# EAGLE design brick_i2c_color_mini (EAGLE 7.4.0)
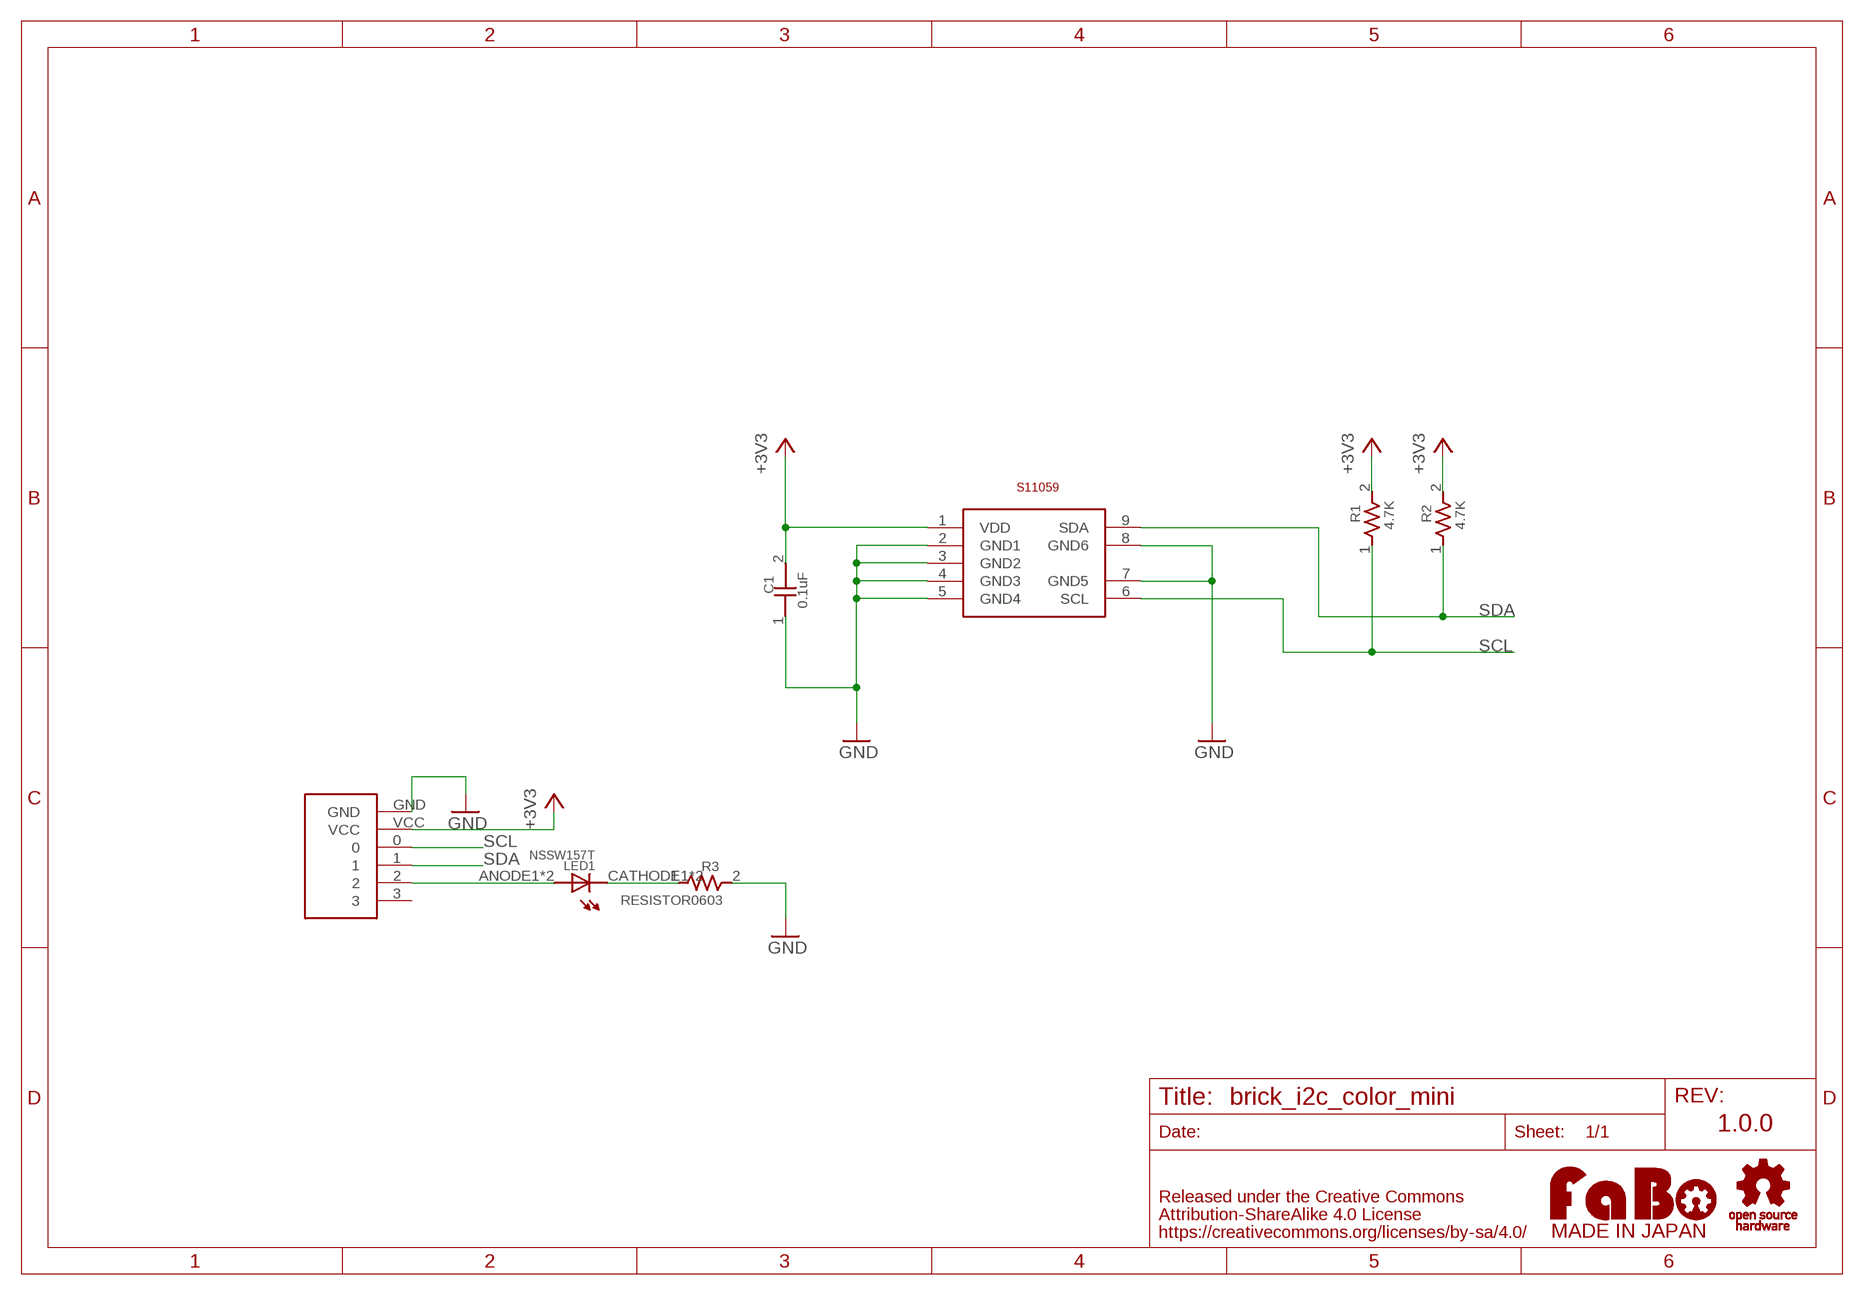
[diagram p0: schematic, sheet 1]

## Parts
C1  0.1uF  CAPACITOR0603  [0603]
LED1  NSSW157T  [NSSW157T]
R1  4.7K  RESISTOR0603  [0603]
R2  4.7K  RESISTOR0603  [0603]
R3  RESISTOR0603  [0603]
S1  HAMAMATSU-S11059  [HAMAMATSU-S11059]
U$2  LOGO_FABO-S_BOTTOM  [LOGO_FABO_S_BOTTOM]
U$3  LOGO_OSHW-S_BOTTOM  [LOGO_OSHW_S_BOTTOM]
U$4  FABO-NANO  [FABO-NANO]

## Nets
+3V3: C1.2 R1.2 R2.2 S1.1(VDD) U$4.VCC
GND: C1.1 R3.2 S1.2(GND1) S1.3(GND2) S1.4(GND3) S1.5(GND4) S1.7(GND5) S1.8(GND6) U$4.GND
N$1: LED1.ANODE1(ANODE) LED1.ANODE2(ANODE) U$4.2
N$2: LED1.CATHODE1(CATHODE) LED1.CATHODE2(CATHODE) R3.1
SCL: R1.1 S1.6(SCL) U$4.0
SDA: R2.1 S1.9(SDA) U$4.1
Unconnected: U$4.3

## Notes on the sheet
- 1.0.0

## Library data of the parts
C1 = GClue-Capacitor:CAPACITOR
LED1 = FaBo-LED:NSSW157T
R1 R2 = GClue-Resistors:RESISTOR
R3 = FaBo-Resistors:RESISTOR
S1 = gclueSensor:HAMAMATSU-S11059
U$2 = FaBo-etc:LOGO_FABO
U$3 = FaBo-etc:LOGO_OSHW
U$4 = FaBo-Template:FABO-NANO

## Board
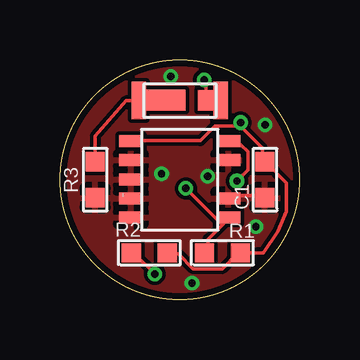
[diagram p1: board, top side]
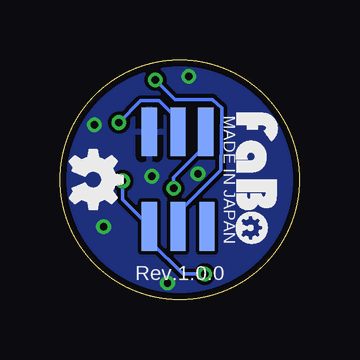
[diagram p2: board, bottom side, seen from below]

Size 10 x 10 mm. Coordinates in mm from the lower left corner, seen from the top.
Copper layers (1*16): Top 0.035mm / dielectric 1.5mm / Bottom 0.035mm
Design rules "Elecrow_2-layer_eagle_rule": minimum track width 6mil, minimum drill 12mil, track to track 6mil, track to pad 6mil, pad to pad 6mil, via to via 6mil, smd to smd 0mil, copper to edge 10mil, drill to drill 10mil, minimum pad ring 10mil, minimum via ring 6mil, stop-mask expansion 2mil, vias tented up to drill 100mil, thermal gap 10mil

### Footprints (pad centres in the part's own frame; a part is rotated, then mirrored left to right if it is on the bottom)
0603 = smd 0.8 x 0.8: 1 -0.75,0; 2 0.75,0
NSSW157T = smd 0.6 x 1.55: ANODE1 1.7,0.01; CATHODE2 -1.71,0.01 | smd 0.64 x 0.86: ANODE2 1.08,0.01 | smd 1.66 x 0.86: CATHODE1 -0.59,0.02
HAMAMATSU-S11059 = smd 1 x 0.5: 1 -2.04,1.62; 2 -2.04,0.82; 3 -2.04,0.02; 4 -2.04,-0.78; 5 -2.04,-1.58; 6 2.03,-1.58; 7 2.03,-0.78; 8 2.03,0.82; 9 2.03,1.62
FABO-NANO = smd 0.635 x 2.032 bottom: 0 -1.08,2; 1 1.27,-1.95; 2 0.07,-1.95; 3 -1.13,-1.95; GND 1.27,2; VCC 0.07,2

### Placement (x,y rotation side)
C1  8.56,5 90 top
LED1  5,8.3 0 top
R1  6.78,1.95 0 top
R2  3.73,1.95 0 top
R3  1.47,5 270 top
S1  5,5 0 top
U$2  2.66,5 90 top
U$3  8.61,5 90 top
U$4  5,5 0 top

### Tracks (layer width: path | path; a pad name or v marks a point on that pad's centre or on a via)
+3V3  (via drill 0.3)
  Top 0.152: R2.2 4.49,1.9 4.95,1.9 5.56,1.29 6.78,1.29 7.39,1.9 R1.2 8.48,1.95 9.09,2.84 9.45,3.68 9.45,4.87 8.61,5.71 C1.2 8.45,5.86 8.45,6.32 7.54,7.24 | 7.54,7.24 6.47,7.24 5.86,6.63 S1.1 | 7.54,7.24 v7.54,7.39
  Bottom 0.152: v7.54,7.39 6.63,8.3 5.86,8.3 5.1,7.54 5.1,7.08 U$4.VCC
GND  (via drill 0.3)
  Top 0.152: C1.1 8.45,4.34 7.08,4.34 S1.7
  other vias: 8.56,7.29 5.51,0.68 8.18,3.04 4.24,5.25 4.62,9.32 6.17,5.15
  pour Bottom: -1.35,-1.35 11.35,-1.35 11.35,11.35 -1.35,11.35
  pour Top: -1.35,-1.35 11.35,-1.35 11.35,11.35 -1.35,11.35
N$1  (via drill 0.3)
  Top 0.152: LED1.ANODE1 6.63,8.3 6.17,8.3 LED1.ANODE2 6.09,9.04 v6.02,9.17
  Bottom 0.152: v6.02,9.17 5.2,8.35 3.63,8.35 3.25,8 3.27,5.41 4.95,3.73 4.95,3.12 U$4.2
N$2
  Top 0.152: R3.1 1.47,6.83 2.77,8.3 3.27,8.3 LED1.CATHODE2 3.42,8.3 4.34,8.3 LED1.CATHODE1
SCL  (via drill 0.3)
  Top 0.152: 6.78,3.12 6.93,3.27 S1.6 | 6.78,3.12 6.17,2.51 6.17,2.05 R1.1 | v5.25,4.64 6.78,3.12
  Bottom 0.152: v5.25,4.64 5.25,5.1 4.04,6.32 4.04,6.93 U$4.0
SDA  (via drill 0.3)
  Top 0.152: v3.96,1.06 3.12,1.9 R2.1 | v7.39,4.95 7.84,5.41 7.84,6.17 7.54,6.47 7.08,6.47 S1.9
  Bottom 0.152: v3.96,1.06 4.87,1.06 6.17,2.36 6.17,2.97 U$4.1 6.32,3.12 7.39,4.19 v7.39,4.95

### Text on the board
bPlace: MADE IN JAPAN | Rev.1.0.0